# EAGLE design ArduinoShield (EAGLE 9.7.0)
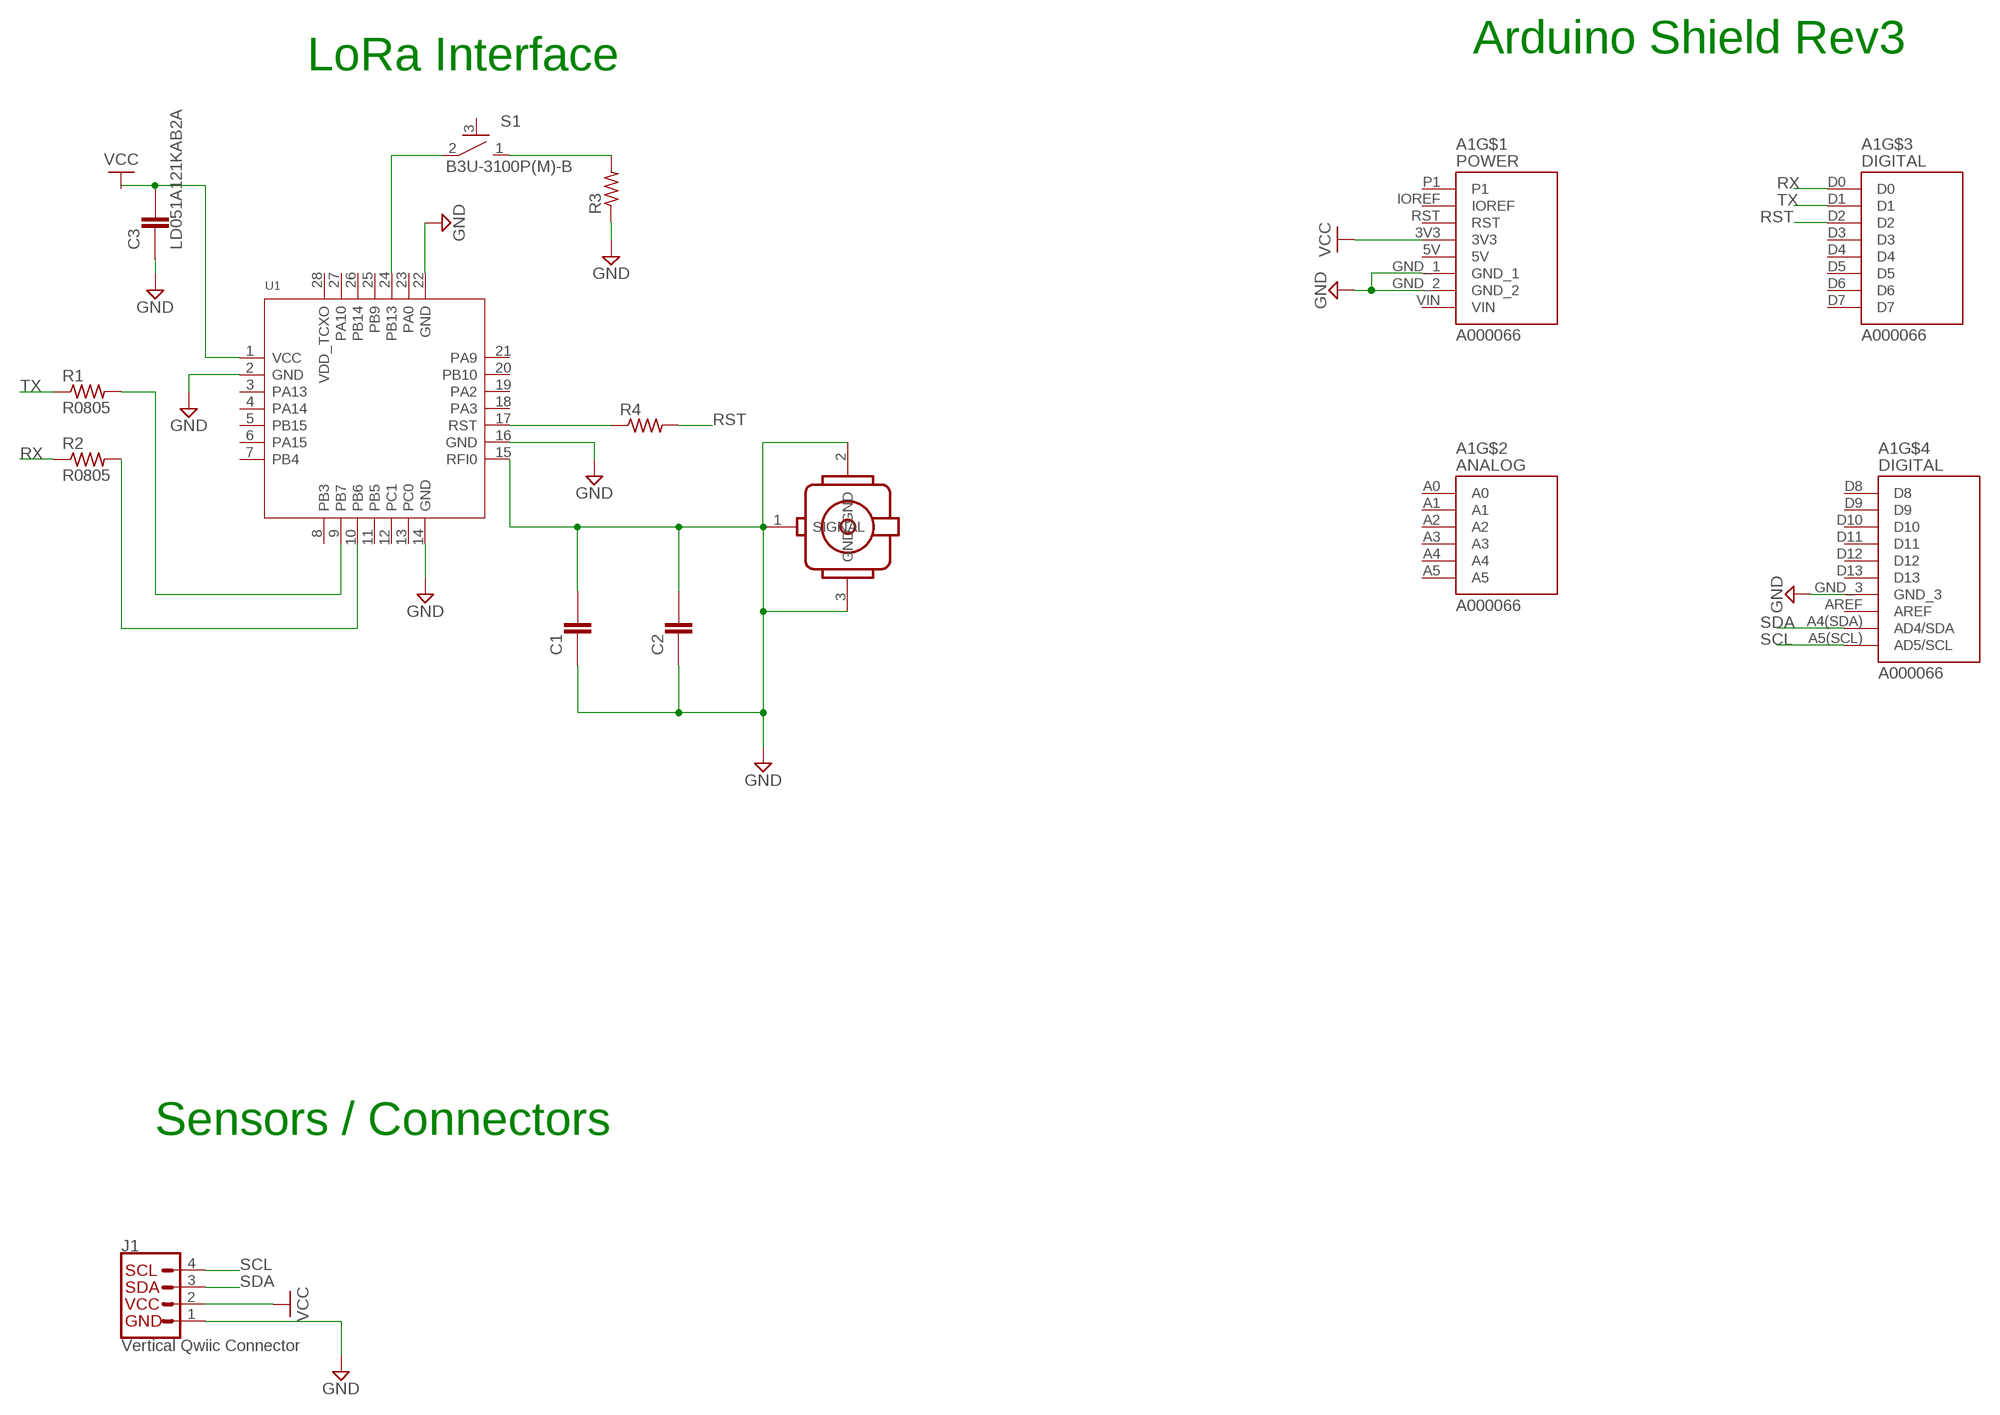
[diagram p0: schematic, sheet 1]

## Parts
A1  A000066  [ARDUINO_A000066]
C1  LD051A121KAB2A  [CAPC2012X140N]
C2  LD051A121KAB2A  [CAPC2012X140N]
C3  LD051A121KAB2A  [CAPC2012X140N]
J1  Vertical Qwiic Connector  QWIIC_CONNECTOR  [JST04_1MM_VERT]
R1  R0805  [RESC2012X65N]
R2  R0805  [RESC2012X65N]
R3  2-2176053-0  [RESC2012X65N]
R4  2-2176053-0  [RESC2012X65N]
S1  B3U-3100P(M)-B  B3U-X100B3U-3100P(M)-B3100P(M)-B  [B3U-3100P(M)-B]
U1  MODULE_LORA_E5  [MODULE28P-1.25-12X12X2.5MM]
U$1  U.FL-R-SMT-1(60)  [U.FL-R-SMT-1(60)]

## Nets
GND: A1.GND_1 A1.GND_2 A1.GND_3 C1.1 C1.2 C2.1 C2.2 J1.1 R3.1 U1.2(GND) U1.14(GND) U1.15(RFI0) U1.16(GND) U1.22(GND) U$1.1(SIGNAL) U$1.2(GND) U$1.3(GND)
N$1: R2.2 U1.10(PB6)
N$2: R1.2 U1.9(PB7)
N$4: C3.1 ; supply symbol labelled GND
N$5: R4.1 U1.17(RST)
N$7: S1.2 U1.24(PB13)
N$8: R3.2 S1.1
RST: A1.D2 R4.2
RX: A1.D0 R2.1
SCL: A1.A5(SCL)(AD5/SCL) J1.4
SDA: A1.A4(SDA)(AD4/SDA) J1.3
TX: A1.D1 R1.1
VCC: A1.3V3 C3.2 J1.2 U1.1(VCC)
Unconnected: A1.A0 A1.A1 A1.A2 A1.A3 A1.A4 A1.A5 A1.AREF A1.D3 A1.D4 A1.D5 A1.D6 A1.D7 A1.D8 A1.D9 A1.D10 A1.D11 A1.D12 A1.D13 A1.IOREF A1.P1 A1.RST S1.3 U1.3(PA13) U1.4(PA14) U1.5(PB15) U1.6(PA15) U1.7(PB4) U1.8(PB3) U1.11(PB5) U1.12(PC1) U1.13(PC0) U1.18(PA3) U1.19(PA2) U1.20(PB10) U1.21(PA9) U1.23(PA0) U1.25(PB9) U1.26(PB14) U1.27(PA10) U1.28(VDD_TCXO)

## Notes on the sheet
- Arduino Shield Rev3
- LoRa Interface
- Sensors / Connectors

## Power pins joined to a net without a drawn wire
5V: A1.5V
VIN: A1.VIN

## Library data of the parts
A1 = A000066 (2):A000066: Microcontroller board, Uno [Arduino] A000066 Microcontroller board, Uno 7640152110092; MANUFACTURER: Arduino; MAXIMUM_PACKAGE_HEIGHT: N/A; PARTREV: N/A; STANDARD: Manufacturer Recommendations
C1-C3 = LD051A121KAB2A:LD051A121KAB2A: 120PF 100V 10% 0805
J1 = SparkFun-Connectors:QWIIC_CONNECTOR: SparkFun I2C Standard Qwiic Connector An SMD 1mm pitch JST connector makes it easy and quick (get it? Qwiic?) to connect I2C devices to each other. The Qwiic system <http://www.sparkfun.com/qwiic> enables fast and solderless connection between popular platforms and various sensors and actuators. We carry 200mm <https://www.sparkfun.com/products/14204>, 100mm <https://www.sparkfun.com/products/14205>, 50mm <https://www.sparkfun.com/products/14206>, and breadboard friendly <https://www.sparkfun.com/products/14207> Qwiic cables. We also offer 10 pcs strips <https://www.sparkfun.com/products/14323> the SMD connectors.; PROD_ID: CONN-14483
R1 R2 = Resistor:R0805: RLP73N 2A R33 1% 1K RL; COMMENT: 2-2176053-0; EU_ROHS_COMPLIANCE: Compliant with Exemptions; PACKAGE: 0805
R3 R4 = R0805:2-2176053-0: RLP73N 2A R33 1% 1K RL; COMMENT: 2-2176053-0; EU_ROHS_COMPLIANCE: Compliant with Exemptions; PACKAGE: 0805
S1 = Switch:B3U-X100: Ultra-small Tactile Switch Contact form : SPST-NO Datasheet <https://omronfs.omron.com/en_US/ecb/products/pdf/en-b3u.pdf>; CATEGORY: SWITCH; DESCRIPTION: Ultra-small Surface-mounting Tactile Switches with High Contact Reliability; MAUFACTURER: OMRON; OPERATING_TEMP: -25°C to +70°C at 60%RH max; PART_STATUS: ACTIVE; ROHS_COMPLIANCE: RoHS Compliant; SERIES: B3U; TYPE: Tactile
U1 = LORA-E5_Eagle_Library:MODULE_LORA_E5
U$1 = U.FL-R-SMT-1_60_:U.FL-R-SMT-1(60): Check availability <https://pricing.snapeda.com/parts/U.FL-R-SMT-1%2860%29/Hirose%20Electric/view-part?ref=eda>; AVAILABILITY: In Stock; DESCRIPTION: U.FL (UMCC) Connector Receptacle, Male Pin 50Ohm Surface Mount Solder; MF: Hirose Electric; MP: U.FL-R-SMT-1(60); PACKAGE: None; PRICE: None; PURCHASE-URL: https://pricing.snapeda.com/search/part/U.FL-R-SMT-1(60)/?ref=eda

## Board
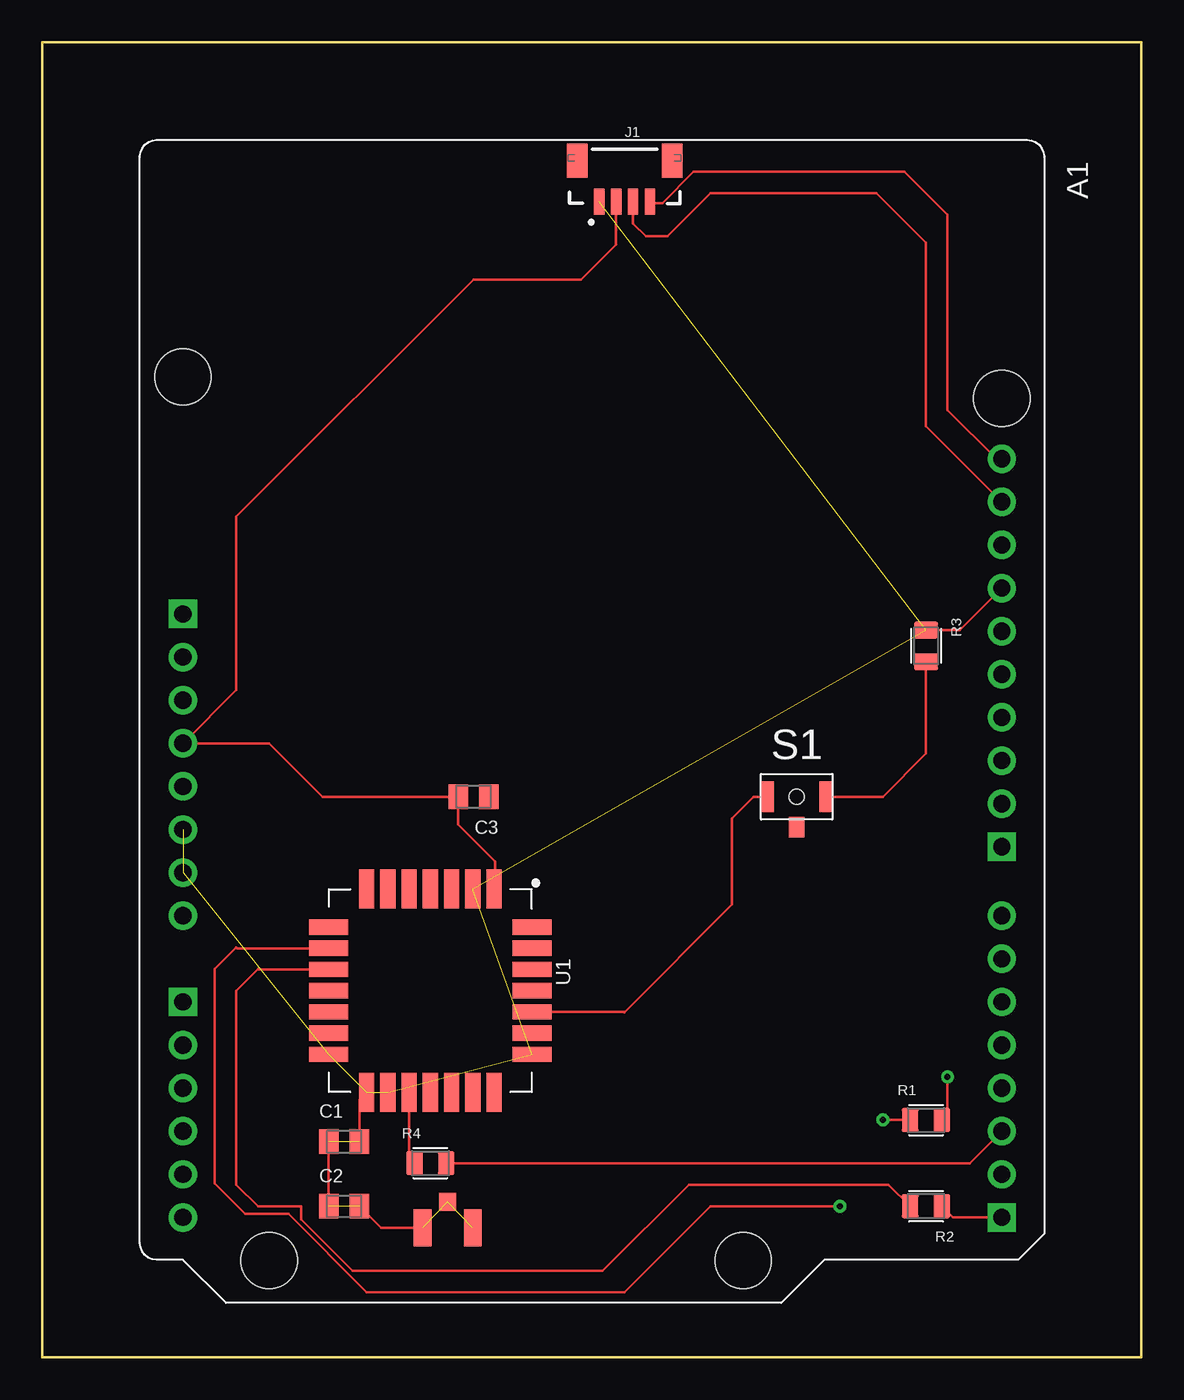
[diagram p1: board, top side]
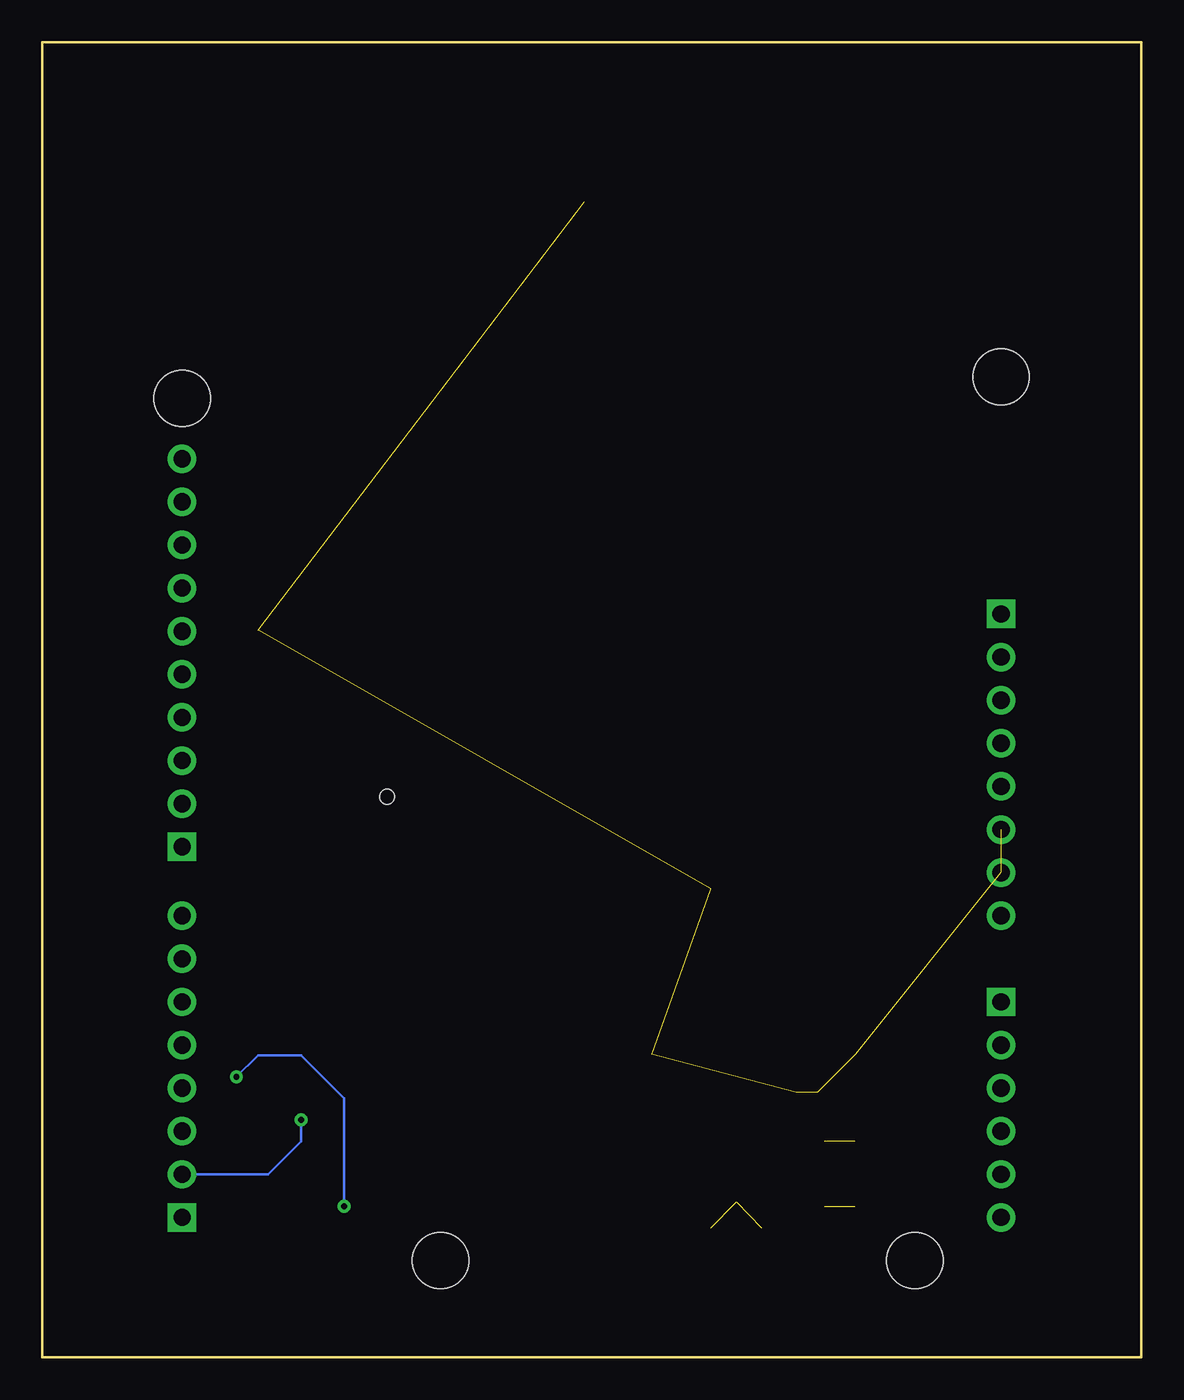
[diagram p2: board, bottom side, seen from below]

Size 64.77 x 77.47 mm. Coordinates in mm from the lower left corner, seen from the top.
Outline: 0,77.47 64.77,77.47 64.77,0 0,0 0,77.47
Copper layers (1*16): Top 0.035mm / dielectric 1.5mm / Bottom 0.035mm
Design rules "default": minimum track width 6mil, minimum drill 0.35mm, track to track 6mil, track to pad 6mil, pad to pad 6mil, via to via 6mil, smd to smd 6mil, copper to edge 40mil, drill to drill 6mil, minimum pad ring 10mil, minimum via ring 8mil, stop-mask expansion 4mil, vias tented up to drill 0mil, thermal gap 10mil

### Footprints (pad centres in the part's own frame; a part is rotated, then mirrored left to right if it is on the bottom)
ARDUINO_A000066 = drill 1.016 pad 1.676: 3V3 35.56,2.54; 5V 38.1,2.54; A1 53.34,2.54; A2 55.88,2.54; A3 58.42,2.54; A4 60.96,2.54; A4(SDA) 21.336,50.8; A5 63.5,2.54; A5(SCL) 18.796,50.8; AREF 23.876,50.8; D1 60.96,50.8; D2 58.42,50.8; D3 55.88,50.8; D4 53.34,50.8; D5 50.8,50.8; D6 48.26,50.8; D7 45.72,50.8; D9 39.116,50.8; D10 36.576,50.8; D11 34.036,50.8; D12 31.496,50.8; D13 28.956,50.8; GND_1 43.18,2.54; GND_2 40.64,2.54; GND_3 26.416,50.8; IOREF 30.48,2.54; RST 33.02,2.54; VIN 45.72,2.54 | drill 1.016 pad 1.676 square: A0 50.8,2.54; D0 63.5,50.8; D8 41.656,50.8; P1 27.94,2.54 | hole 3.3: 66.04,35.56; 66.04,7.62; 15.24,50.8; 13.97,2.54
CAPC2012X140N = smd 1.15 x 1.45: 1 -0.9,0; 2 0.9,0
JST04_1MM_VERT = smd 0.6 x 1.55: 1 -1.478,0.775; 2 -0.478,0.775; 3 0.522,0.775; 4 1.522,0.775 | smd 1.2 x 2: NC1 -2.778,3.2; NC2 2.822,3.2
RESC2012X65N = smd 1 x 1.42: 1 -0.935,0; 2 0.935,0
B3U-3100P(M)-B = smd 0.8 x 1.8: 1 1.75,0; 2 -1.75,0 | smd 0.9 x 1.2: 3 0,-1.8 | hole 0.85: 0,0
MODULE28P-1.25-12X12X2.5MM = smd 2.3 x 0.9: 1 -6,3.75; 2 -6,2.5; 3 -6,1.25; 4 -6,0; 5 -6,-1.25; 6 -6,-2.5; 7 -6,-3.75; 15 6,-3.75; 16 6,-2.5; 17 6,-1.25; 18 6,0; 19 6,1.25; 20 6,2.5; 21 6,3.75 | smd 0.9 x 2.3: 8 -3.75,-6; 9 -2.5,-6; 10 -1.25,-6; 11 0,-6; 12 1.25,-6; 13 2.5,-6; 14 3.75,-6; 22 3.75,6; 23 2.5,6; 24 1.25,6; 25 0,6; 26 -1.25,6; 27 -2.5,6; 28 -3.75,6
U.FL-R-SMT-1(60) = smd 1 x 1.05: 1 0,-1.525 | smd 1.05 x 2.2: 2 1.475,0; 3 -1.475,0

### Placement (x,y rotation side)
A1  5.74,71.73 270 top
C1  17.78,12.7 0 top
C2  17.78,8.89 0 top
C3  25.4,33.02 180 top
J1  34.29,67.31 0 top
R1  52.07,13.97 0 top
R2  52.07,8.89 180 top
R3  52.07,41.91 270 top
R4  22.86,11.43 0 top
S1  44.45,33.02 0 top
U1  22.86,21.59 270 top
U$1  23.88,7.62 180 top

### Tracks (layer width: path | path; a pad name or v marks a point on that pad's centre or on a via)
GND  (12 unrouted)
  Top 0.152: U$1.2 19.95,7.62 C2.2 | C1.2 18.68,15.16 U1.15 | A1.GND_3 54.07,42.84 R3.1 | C1.1 C2.1
N$1
  Top 0.152: U1.10 12.72,22.84 12.7,22.86 11.43,21.59 11.43,10.16 12.7,8.89 15.24,8.89 15.24,8.12 18.28,5.08 33.02,5.08 38.1,10.16 49.86,10.16 R2.2
N$2  (via drill 0.35)
  Top 0.152: U1.9 11.47,24.09 11.43,24.13 10.16,22.86 10.16,10.23 11.96,8.43 14.5,8.43 19.12,3.81 34.29,3.81 39.37,8.89 v46.99,8.89 | v53.34,16.51 53.34,14.3 R1.2
  Bottom 0.152: v46.99,8.89 46.99,15.24 49.53,17.78 52.07,17.78 v53.34,16.51
N$5
  Top 0.152: U1.17 21.61,11.75 R4.1
N$7
  Top 0.152: U1.24 34.27,20.34 34.29,20.32 40.64,26.67 40.64,31.75 41.91,33.02 S1.2
N$8
  Top 0.152: R3.2 52.07,35.56 49.53,33.02 S1.1
RST
  Top 0.152: R4.2 54.66,11.43 A1.D2
RX
  Top 0.152: A1.D0 53.66,8.23 R2.1
SCL
  Top 0.152: A1.A5(SCL) 56.22,52.93 53.34,55.81 53.34,67.31 50.8,69.85 38.38,69.85 36.54,68.01 35.89,68.01 J1.4
SDA
  Top 0.152: A1.A4(SDA) 52.07,54.86 52.07,65.67 49.16,68.58 39.37,68.58 36.83,66.04 35.56,66.04 34.81,66.79 J1.3
TX  (via drill 0.35)
  Top 0.152: R1.1 v49.53,13.97
  Bottom 0.152: v49.53,13.97 49.53,12.7 51.46,10.77 A1.D1
VCC
  Top 0.152: U1.1 26.67,27.65 26.67,29.21 24.5,31.38 C3.2 16.51,33.02 13.36,36.17 A1.3V3 11.43,39.32 11.43,49.53 25.4,63.5 31.75,63.5 33.81,65.56 J1.2